# Altium project PWR_MNG.PRJPCB
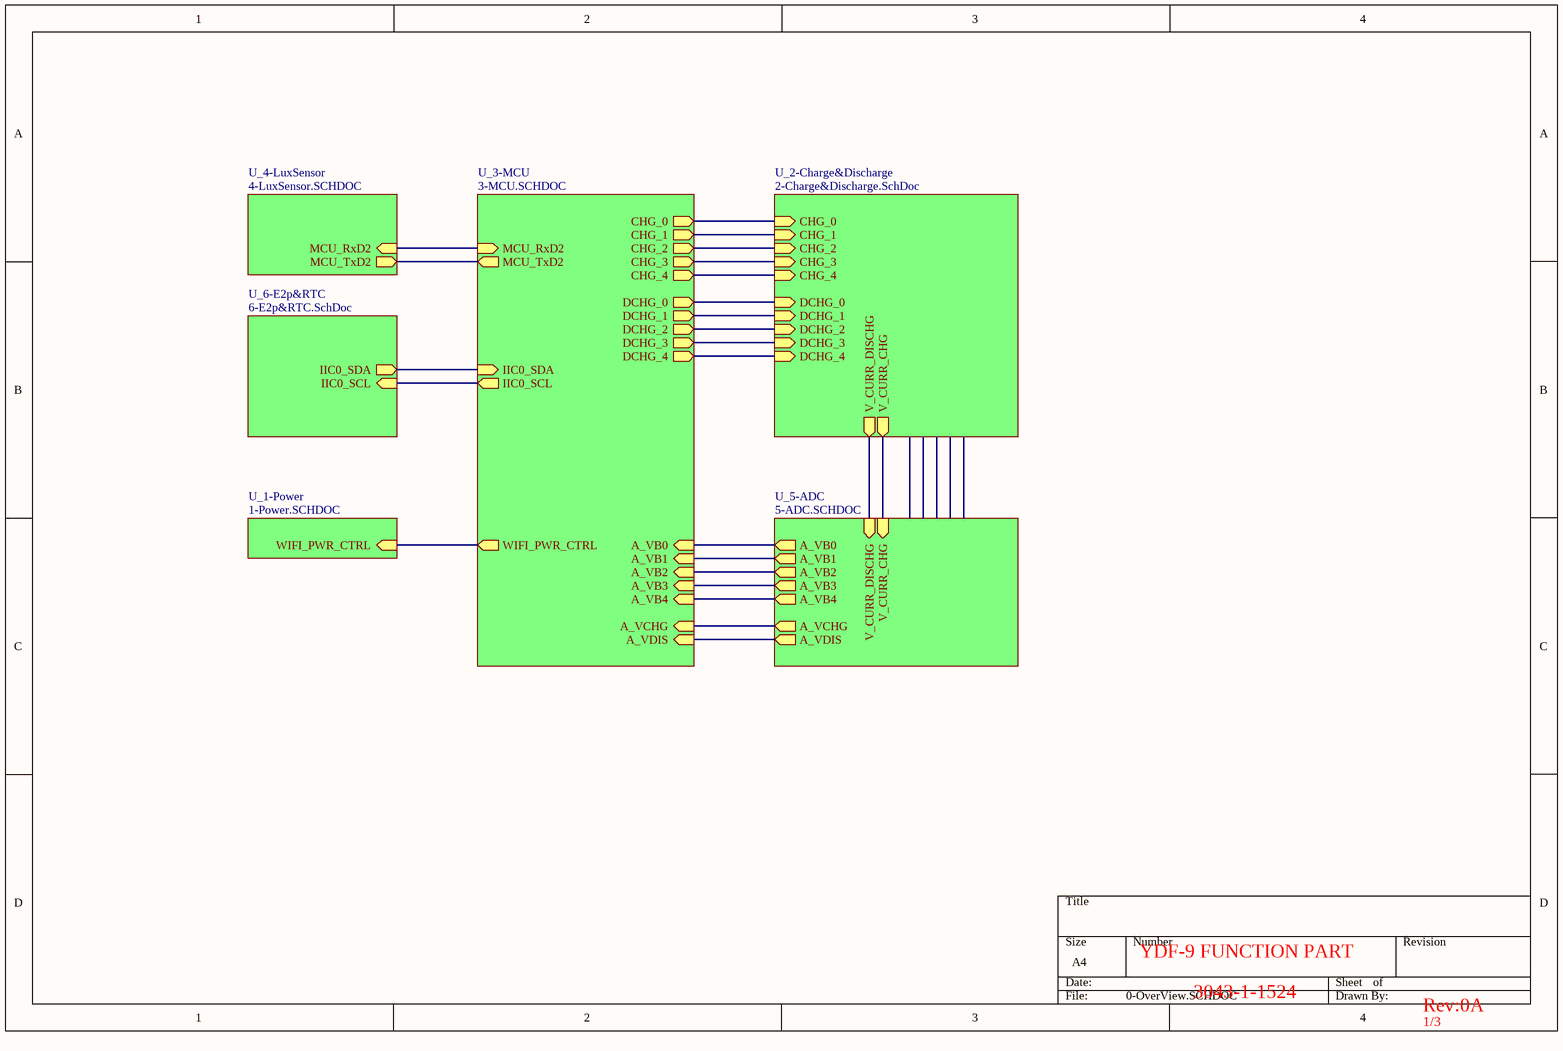
[diagram p0: 0-OverView.SCHDOC]
.TITLE: aaaaa
7 sheets, 72 parts. Net scope: hierarchical (ports join the sheet entries above them; power ports are global).
Board file: 3043-1-1532.PcbDoc
Sheets:
  0-OverView.SCHDOC
    U_2-Charge&Discharge = 2-Charge&Discharge.SchDoc
    U_1-Power = 1-Power.SCHDOC
    U_3-MCU = 3-MCU.SCHDOC
    U_5-ADC = 5-ADC.SCHDOC
    U_6-E2p&RTC = 6-E2p&RTC.SchDoc
    U_4-LuxSensor = 4-LuxSensor.SCHDOC

## Sheet 0-OverView.SCHDOC
size A4

### Sub-sheets
U_1-Power = 1-Power.SCHDOC: WIFI_PWR_CTRL (in)
U_2-Charge&Discharge = 2-Charge&Discharge.SchDoc: V_CURR_CHG (out), V_CURR_DISCHG (out), CHG_2 (in), CHG_3 (in), DCHG_0 (in), CHG_4 (in), CHG_0 (in), DCHG_1 (in), CHG_1 (in), DCHG_2 (in), DCHG_3 (in), DCHG_4 (in)
U_3-MCU = 3-MCU.SCHDOC: IIC0_SDA (in), IIC0_SCL (out), A_VDIS (in), A_VCHG (in), A_VB1 (in), A_VB4 (in), A_VB2 (in), A_VB3 (in), CHG_3 (out), CHG_4 (out), CHG_0 (out), CHG_1 (out), CHG_2 (out), DCHG_0 (out), DCHG_1 (out), DCHG_2 (out), DCHG_3 (out), A_VB0 (in), DCHG_4 (out), WIFI_PWR_CTRL (out), MCU_TxD2 (out), MCU_RxD2 (in)
U_4-LuxSensor = 4-LuxSensor.SCHDOC: MCU_RxD2 (in), MCU_TxD2 (out)
U_5-ADC = 5-ADC.SCHDOC: A_VDIS (out), A_VB3 (out), A_VB1 (out), A_VB4 (out), A_VCHG (out), A_VB2 (out), V_CURR_DISCHG (in), V_CURR_CHG (in), A_VB0 (out)
U_6-E2p&RTC = 6-E2p&RTC.SchDoc: IIC0_SCL (in), IIC0_SDA (out)

### Nets
A_VB0: sheet U_3-MCU/A_VB0, sheet U_5-ADC/A_VB0
A_VB1: sheet U_3-MCU/A_VB1, sheet U_5-ADC/A_VB1
A_VB2: sheet U_3-MCU/A_VB2, sheet U_5-ADC/A_VB2
A_VB3: sheet U_3-MCU/A_VB3, sheet U_5-ADC/A_VB3
A_VB4: sheet U_3-MCU/A_VB4, sheet U_5-ADC/A_VB4
A_VCHG: sheet U_2-Charge&Discharge/V_CURR_CHG, sheet U_3-MCU/A_VCHG, sheet U_5-ADC/A_VCHG, sheet U_5-ADC/V_CURR_CHG
A_VDIS: sheet U_2-Charge&Discharge/V_CURR_DISCHG, sheet U_3-MCU/A_VDIS, sheet U_5-ADC/A_VDIS, sheet U_5-ADC/V_CURR_DISCHG
CHG_0: sheet U_2-Charge&Discharge/CHG_0, sheet U_3-MCU/CHG_0
CHG_1: sheet U_2-Charge&Discharge/CHG_1, sheet U_3-MCU/CHG_1
CHG_2: sheet U_2-Charge&Discharge/CHG_2, sheet U_3-MCU/CHG_2
CHG_3: sheet U_2-Charge&Discharge/CHG_3, sheet U_3-MCU/CHG_3
CHG_4: sheet U_2-Charge&Discharge/CHG_4, sheet U_3-MCU/CHG_4
DCHG_0: sheet U_2-Charge&Discharge/DCHG_0, sheet U_3-MCU/DCHG_0
DCHG_1: sheet U_2-Charge&Discharge/DCHG_1, sheet U_3-MCU/DCHG_1
DCHG_2: sheet U_2-Charge&Discharge/DCHG_2, sheet U_3-MCU/DCHG_2
DCHG_3: sheet U_2-Charge&Discharge/DCHG_3, sheet U_3-MCU/DCHG_3
DCHG_4: sheet U_2-Charge&Discharge/DCHG_4, sheet U_3-MCU/DCHG_4
IIC0_SCL: sheet U_3-MCU/IIC0_SCL, sheet U_6-E2p&RTC/IIC0_SCL
IIC0_SDA: sheet U_3-MCU/IIC0_SDA, sheet U_6-E2p&RTC/IIC0_SDA
MCU_RxD2: sheet U_3-MCU/MCU_RxD2, sheet U_4-LuxSensor/MCU_RxD2
MCU_TxD2: sheet U_3-MCU/MCU_TxD2, sheet U_4-LuxSensor/MCU_TxD2
WIFI_PWR_CTRL: sheet U_1-Power/WIFI_PWR_CTRL, sheet U_3-MCU/WIFI_PWR_CTRL

### Notes on the sheet
- YDF-9 FUNCTION PART
- 3043-1-1524
- Rev:0A
- 1/3

## Sheet 2-Charge&Discharge.SchDoc
size A4
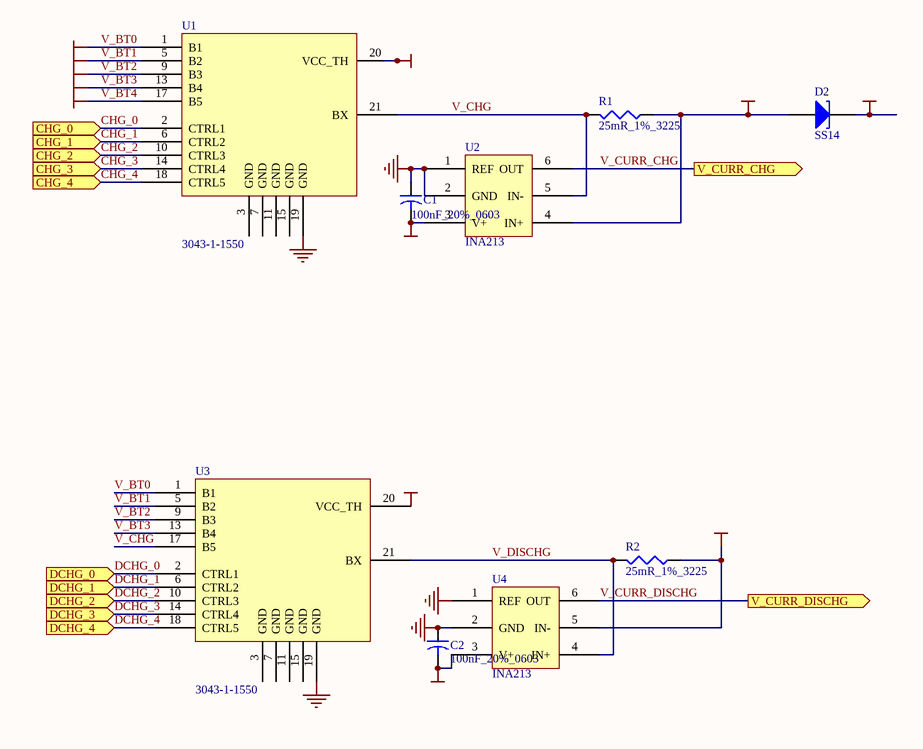
[diagram p1: 2-Charge&Discharge.SchDoc]

### Parts
C1  100nF_20%_0603  [C1608-0603]
C2  100nF_20%_0603  [C1608-0603]
D2  SS14  [DO-214AB_SS14]
R1  25mR_1%_3225  [CC3216-1206]
R2  25mR_1%_3225  [CC3216-1206]
U1  3043-1-1550  [3043-1-1550_V1.10]
U2  INA213  [SC70-6]
U3  3043-1-1550  [3043-1-1550_V1.10]
U4  INA213  [SC70-6]

### Ports
CHG_0 (in), CHG_1 (in), CHG_2 (in), CHG_3 (in), CHG_4 (in), DCHG_0 (in), DCHG_1 (in), DCHG_2 (in), DCHG_3 (in), DCHG_4 (in), V_CURR_CHG (out), V_CURR_DISCHG (out)

### Nets
GND: C1.1 C2.1 U1.19(GND) U2.1(REF) U2.2(GND) U3.19(GND) U4.1(REF) U4.2(GND)
V_BT0: U1.1(B1) U3.1(B1)
V_BT1: U1.5(B2) U3.5(B2)
V_BT2: U1.9(B3) U3.9(B3)
V_BT3: U1.13(B4) U3.13(B4)
V_BT4: D2.2(K) U1.17(B5)
VCC_2V8: C1.2 C2.2 U2.3(V+) U4.3(V+)
VCC_BAT: R2.1 U4.5(IN-)
VCC_CHARGE: D2.1(A) R1.1 U2.4(IN+)
VCC_TH: U1.20(VCC_TH) U3.20(VCC_TH)
CHG_0: U1.2(CTRL1) ; port CHG_0
CHG_1: U1.6(CTRL2) ; port CHG_1
CHG_2: U1.10(CTRL3) ; port CHG_2
CHG_3: U1.14(CTRL4) ; port CHG_3
CHG_4: U1.18(CTRL5) ; port CHG_4
DCHG_0: U3.2(CTRL1) ; port DCHG_0
DCHG_1: U3.6(CTRL2) ; port DCHG_1
DCHG_2: U3.10(CTRL3) ; port DCHG_2
DCHG_3: U3.14(CTRL4) ; port DCHG_3
DCHG_4: U3.18(CTRL5) ; port DCHG_4
V_CHG: R1.2 U1.21(BX) U2.5(IN-) U3.17(B5)
V_CURR_CHG: U2.6(OUT) ; port V_CURR_CHG  [project net A_VCHG]
V_CURR_DISCHG: U4.6(OUT) ; port V_CURR_DISCHG  [project net A_VDIS]
V_DISCHG: R2.2 U3.21(BX) U4.4(IN+)

Not connected (* = marked no-connect by the designer): U1 3(GND) 7(GND) 11(GND) 15(GND); U3 3(GND) 7(GND) 11(GND) 15(GND)

### Library data of the parts
C1 C2 = Cap2: Capacitor; Value: 0.1uF 20% 0603; Published: 23-Sep-2002; Publisher: Altium Limited
D2 = D Tunnel1: Tunnel Diode - RLC Model; Published: 8-Jun-2000; LatestRevisionDate: 17-Jul-2002; LatestRevisionNote: Re-released for DXP Platform.; Publisher: Altium Limited
R1 R2 = Res3: Resistor; Value: 150R %5 0603; Published: 8-Jun-2000; Revision: July-2002: Re-released for DXP Platform.; Publisher: Altium Limited

## Sheet 1-Power.SCHDOC
size A4
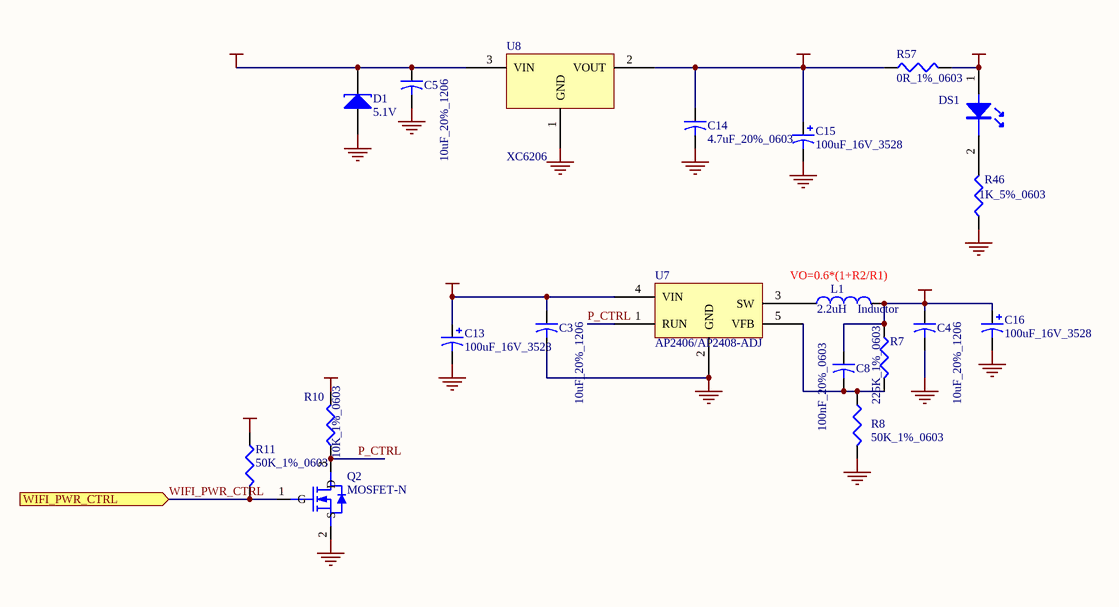
[diagram p2: 1-Power.SCHDOC]

### Parts
C3  10uF_20%_1206  [CC3216-1206]
C4  10uF_20%_1206  [CC3216-1206]
C5  10uF_20%_1206  [CC3216-1206]
C8  100nF_20%_0603  [C1608-0603]
C13  100uF_16V_3528  [CAP_T_B(3528)]
C14  4.7uF_20%_0603  [C1608-0603]
C15  100uF_16V_3528  [CAP_T_B(3528)]
C16  100uF_16V_3528  [CAP_T_B(3528)]
D1  5.1V  [LED0805]
DS1  LED  [LED0805]  (value not drawn)
L1  Inductor  value 2.2uH  [L4x4x2_3A]
Q2  MOSFET-N  [SO-G3/C2.5]
R7  225K_1%_0603  [C1608-0603]
R8  50K_1%_0603  [C1608-0603]
R10  10K_1%_0603  [C1608-0603]
R11  50K_1%_0603  [C1608-0603]
R46  1K_5%_0603  [C1608-0603]
R57  0R_1%_0603  [C1608-0603]
U7  AP2406/AP2408-ADJ  [SOT23-5]
U8  XC6206  [SO-G3/C2.5]

### Ports
WIFI_PWR_CTRL (in)

### Nets
GND: C3.2 C4.2 C5.2 C13.2 C14.2 C15.2 C16.2 D1.1(A) Q2.2(S) R8.2 R46.1 U7.2(GND) U8.1(GND)
V_2V8: C14.1 C15.1 R57.1 U8.2(VOUT)
V_BT4: C3.1 C5.1 C13.1 D1.2(K) R10.2 R11.1 U7.4(VIN) U8.3(VIN)
VCC_2V8: DS1.1 R57.2
VCC_3V3: C4.1 C8.1 C16.1 L1.2 R7.1
P_CTRL: Q2.3(D) R10.1 U7.1(RUN)
WIFI_PWR_CTRL: Q2.1(G) R11.2 ; port WIFI_PWR_CTRL
NetC8_2: C8.2 R7.2 R8.1 U7.5(VFB)
NetDS1_2: DS1.2 R46.2
NetL1_1: L1.1 U7.3(SW)

### Notes on the sheet
- VO=0.6*(1+R2/R1)

### Library data of the parts
C3-C5 = Cap2: Capacitor; Value: 10uF; Published: 23-Sep-2002; Publisher: Altium Limited
C8 = Cap2: Capacitor; Value: 0.1uF; Published: 23-Sep-2002; Publisher: Altium Limited
C13 C15 C16 = Cap Pol2: Polarized Capacitor (Axial); Value: 100uF/16V; Published: 8-Jun-2000; Revision: July-2002: Re-released for DXP Platform.; Publisher: Altium Limited
C14 = Cap2: Capacitor; Value: 0.1uF 20% 0603; Published: 23-Sep-2002; Publisher: Altium Limited
D1 = D Tunnel1: Tunnel Diode - RLC Model; Published: 8-Jun-2000; LatestRevisionDate: 17-Jul-2002; LatestRevisionNote: Re-released for DXP Platform.; Publisher: Altium Limited
R7 R8 R10 R11 R57 = Res3: Resistor; Value: 1K%5 0603; Published: 8-Jun-2000; Revision: July-2002: Re-released for DXP Platform.; Publisher: Altium Limited
R46 = Res3: Resistor; Value: 1K; Published: 8-Jun-2000; Revision: July-2002: Re-released for DXP Platform.; Publisher: Altium Limited
U7 = AP2406
L1 = Inductor: Published: 8-Jun-2000; Revision: July-2002: Re-released for DXP Platform.; Publisher: Altium Limited

## Sheet 3-MCU.SCHDOC
size A4
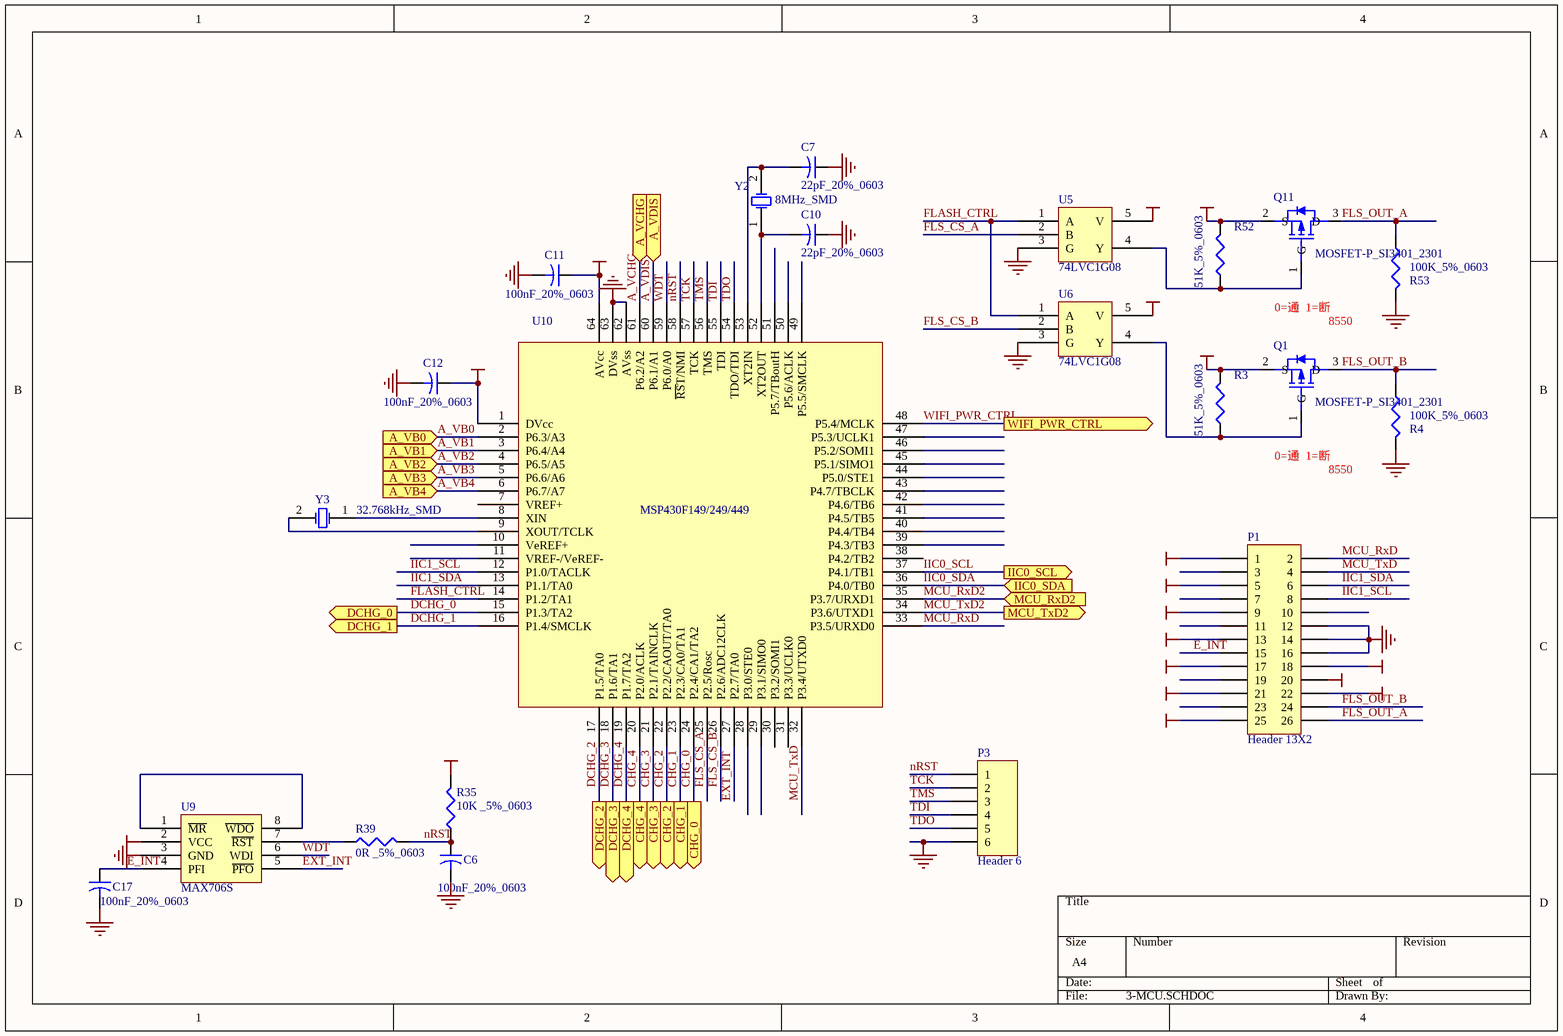
[diagram p3: 3-MCU.SCHDOC]

### Parts
C6  100nF_20%_0603  [C1608-0603]
C7  22pF_20%_0603  [C1608-0603]
C10  22pF_20%_0603  [C1608-0603]
C11  100nF_20%_0603  [C1608-0603]
C12  100nF_20%_0603  [C1608-0603]
C17  100nF_20%_0603  [C1608-0603]
P1  Header 13X2  [HDR2.54_2x13]
P3  Header 6  [SH-06S]
Q1  MOSFET-P_SI3401_2301  [SO-G3/C2.5]
Q11  MOSFET-P_SI3401_2301  [SO-G3/C2.5]
R3  51K_5%_0603  [C1608-0603]
R4  100K_5%_0603  [C1608-0603]
R35  10K _5%_0603  [C1608-0603]
R39  0R _5%_0603  [C1608-0603]
R52  51K_5%_0603  [C1608-0603]
R53  100K_5%_0603  [C1608-0603]
U5  74LVC1G08  [SOT23-5]
U6  74LVC1G08  [SOT23-5]
U9  MAX706S  [SO-8]
U10  MSP430F149/249/449  [QFP-64]
Y2  8MHz_SMD  [XTAL-P4mm_SMD]
Y3  32.768kHz_SMD  [XTAL-3216]

### Ports
A_VB0 (in), A_VB1 (in), A_VB2 (in), A_VB3 (in), A_VB4 (in), A_VCHG (in), A_VDIS (in), CHG_0 (out), CHG_1 (out), CHG_2 (out), CHG_3 (out), CHG_4 (out), DCHG_0 (out), DCHG_1 (out), DCHG_2 (out), DCHG_3 (out), DCHG_4 (out), IIC0_SCL (out), IIC0_SDA (in), MCU_RxD2 (in), MCU_TxD2 (out), WIFI_PWR_CTRL (out)

### Nets
GND: C6.2 C7.1 C10.1 C11.2 C12.2 C17.2 P1.12 P1.14 P1.16 P3.6 R4.2 R53.2 U5.3(G) U6.3(G) U9.3(GND) U10.62(AVss) U10.63(DVss)
V_BT0: P1.1
V_BT1: P1.5
V_BT2: P1.9
V_BT3: P1.13
V_BT4: P1.17 P1.18
VCC_2V8: C11.1 C12.1 P1.20 Q1.2(S) Q11.2(S) R3.2 R35.2 R52.2 U5.5(V) U6.5(V) U9.2(VCC) U10.1(DVcc) U10.64(AVcc)
VCC_BAT: P1.25
VCC_CHARGE: P1.21 P1.22
A_VB0: U10.2(P6.3/A3) ; port A_VB0
A_VB1: U10.3(P6.4/A4) ; port A_VB1
A_VB2: U10.4(P6.5/A5) ; port A_VB2
A_VB3: U10.5(P6.6/A6) ; port A_VB3
A_VB4: U10.6(P6.7/A7) ; port A_VB4
A_VCHG: U10.61(P6.2/A2) ; port A_VCHG
A_VDIS: U10.60(P6.1/A1) ; port A_VDIS
CHG_0: U10.24(P2.4/CA1/TA2) ; port CHG_0
CHG_1: U10.23(P2.3/CA0/TA1) ; port CHG_1
CHG_2: U10.22(P2.2/CAOUT/TA0) ; port CHG_2
CHG_3: U10.21(P2.1/TAINCLK) ; port CHG_3
CHG_4: U10.20(P2.0/ACLK) ; port CHG_4
DCHG_0: U10.15(P1.3/TA2) ; port DCHG_0
DCHG_1: U10.16(P1.4/SMCLK) ; port DCHG_1
DCHG_2: U10.17(P1.5/TA0) ; port DCHG_2
DCHG_3: U10.18(P1.6/TA1) ; port DCHG_3
DCHG_4: U10.19(P1.7/TA2) ; port DCHG_4
E_INT: C17.1 P1.15 U9.4(PFI)
EXT_INT: U9.5(~{PFO}) U10.27(P2.7/TA0)
FLASH_CTRL: U5.1(A) U6.1(A) U10.14(P1.2/TA1)
FLS_CS_A: U5.2(B) U10.25(P2.5/Rosc)
FLS_CS_B: U6.2(B) U10.26(P2.6/ADC12CLK)
FLS_OUT_A: P1.26 Q11.3(D) R53.1
FLS_OUT_B: P1.24 Q1.3(D) R4.1
IIC0_SCL: U10.37(P4.1/TB1) ; port IIC0_SCL
IIC0_SDA: U10.36(P4.0/TB0) ; port IIC0_SDA
IIC1_SCL: P1.8 U10.12(P1.0/TACLK)
IIC1_SDA: P1.6 U10.13(P1.1/TA0)
MCU_RxD: P1.2 U10.33(P3.5/URXD0)
MCU_RxD2: U10.35(P3.7/URXD1) ; port MCU_RxD2
MCU_TxD: P1.4 U10.32(P3.4/UTXD0)
MCU_TxD2: U10.34(P3.6/UTXD1) ; port MCU_TxD2
nRST: C6.1 P3.1 R35.1 R39.2 U10.58(~{RS}T/NMI)
TCK: P3.2 U10.57(TCK)
TDI: P3.4 U10.55(TDI)
TDO: P3.5 U10.54(TDO/TDI)
TMS: P3.3 U10.56(TMS)
WDT: U9.6(WDI) U10.59(P6.0/A0)
WIFI_PWR_CTRL: U10.48(P5.4/MCLK) ; port WIFI_PWR_CTRL
NetC7_2: C7.2 U10.53(XT2IN) Y2.2(OSC2)
NetC10_2: C10.2 U10.52(XT2OUT) Y2.1(OSC1)
NetQ1_1: Q1.1(G) R3.1 U6.4(Y)
NetQ11_1: Q11.1(G) R52.1 U5.4(Y)
NetR39_1: R39.1 U9.7(~{RST})
NetU9_1: U9.1(~{MR}) U9.8(~{WDO})
NetU10_8: U10.8(XIN) Y3.1(OSC1)
NetU10_9: U10.9(XOUT/TCLK) Y3.2(OSC2)

Not connected (* = marked no-connect by the designer): P1 3 7 10 11 19 23; U10 7(VREF+) 10(VeREF+) 11(VREF-/VeREF-) 28(P3.0/STE0) 29(P3.1/SIMO0) 30(P3.2/SOMI1) 31(P3.3/UCLK0) 38(P4.2/TB2) 39(P4.3/TB3) 40(P4.4/TB4) 41(P4.5/TB5) 42(P4.6/TB6) 43(P4.7/TBCLK) 44(P5.0/STE1) 45(P5.1/SIMO1) 46(P5.2/SOMI1) 47(P5.3/UCLK1) 49(P5.5/SMCLK) 50(P5.6/ACLK) 51(P5.7/TBoutH)

### Notes on the sheet
- 0=通  1=断
- 8550

### Library data of the parts
C6 C17 = Cap2: Capacitor; Value: 0.1uF 0603; Published: 23-Sep-2002; Publisher: Altium Limited
C7 C10-C12 = Cap2: Capacitor; Value: 0.1uF 20% 0603; Published: 23-Sep-2002; Publisher: Altium Limited
P1 = Header 13X2: Header, 13-Pin, Dual row; LatestRevisionDate: 17-Jul-2002; LatestRevisionNote: Re-released for DXP Platform.; Publisher: Altium Limited
P3 = Header 6: Header, 6-Pin; LatestRevisionDate: 17-Jul-2002; LatestRevisionNote: Re-released for DXP Platform.; Publisher: Altium Limited
Q1 Q11 = MOSFET-P
R3 R4 R52 R53 = Res3: Resistor; Published: 8-Jun-2000; Revision: July-2002: Re-released for DXP Platform.; Publisher: Altium Limited
R35 R39 = Res3: Resistor; Value: 1M %5 0603_NC; Published: 8-Jun-2000; Revision: July-2002: Re-released for DXP Platform.; Publisher: Altium Limited
U9 = MAX706
Y2 Y3 = XTAL: Crystal Oscillator; Published: 8-Jun-2000; Revision: July-2002: Re-released for DXP Platform.; Publisher: Altium Limited

## Sheet 5-ADC.SCHDOC
size A4
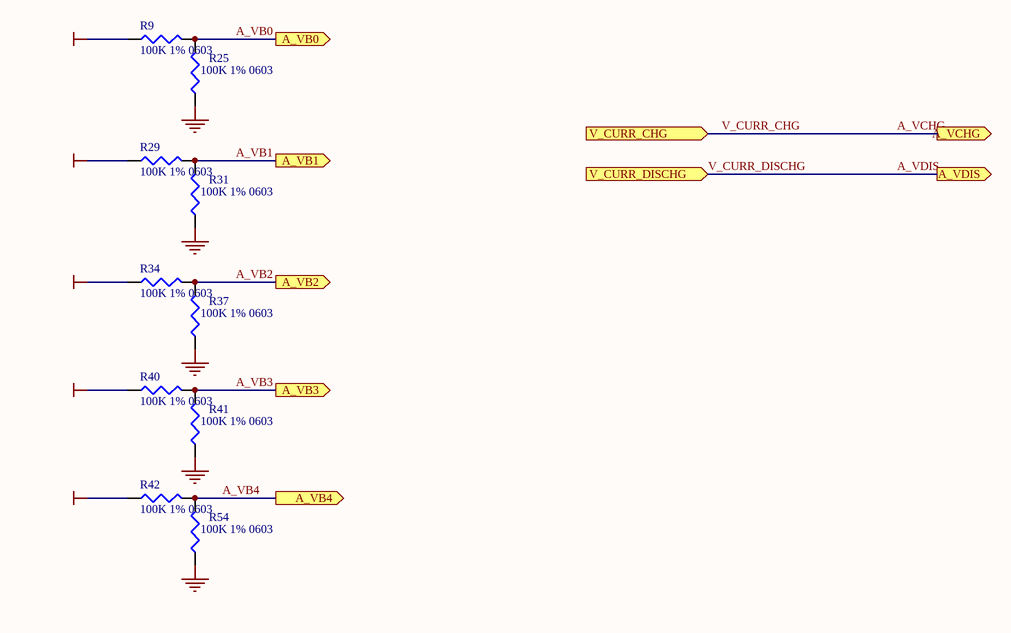
[diagram p4: 5-ADC.SCHDOC]

### Parts
R9  value 100K 1% 0603  [C1608-0603]  (hidden comment: 1K_5%_0603)
R25  value 100K 1% 0603  [C1608-0603]  (hidden comment: 1K_5%_0603)
R29  value 100K 1% 0603  [C1608-0603]  (hidden comment: 1K_5%_0603)
R31  value 100K 1% 0603  [C1608-0603]  (hidden comment: 1K_5%_0603)
R34  value 100K 1% 0603  [C1608-0603]  (hidden comment: 1K_5%_0603)
R37  value 100K 1% 0603  [C1608-0603]  (hidden comment: 1K_5%_0603)
R40  value 100K 1% 0603  [C1608-0603]  (hidden comment: 1K_5%_0603)
R41  value 100K 1% 0603  [C1608-0603]  (hidden comment: 1K_5%_0603)
R42  value 100K 1% 0603  [C1608-0603]  (hidden comment: 1K_5%_0603)
R54  value 100K 1% 0603  [C1608-0603]  (hidden comment: 1K_5%_0603)

### Ports
A_VB0 (out), A_VB1 (out), A_VB2 (out), A_VB3 (out), A_VB4 (out), A_VCHG (out), A_VDIS (out), V_CURR_CHG (in), V_CURR_DISCHG (in)

### Nets
GND: R25.1 R31.1 R37.1 R41.1 R54.1
V_BT0: R9.1
V_BT1: R29.1
V_BT2: R34.1
V_BT3: R40.1
V_BT4: R42.1
A_VB0: R9.2 R25.2 ; port A_VB0
A_VB1: R29.2 R31.2 ; port A_VB1
A_VB2: R34.2 R37.2 ; port A_VB2
A_VB3: R40.2 R41.2 ; port A_VB3
A_VB4: R42.2 R54.2 ; port A_VB4
A_VCHG: port A_VCHG, port V_CURR_CHG  [also labelled V_CURR_CHG]
A_VDIS: port A_VDIS, port V_CURR_DISCHG  [also labelled V_CURR_DISCHG]

### Library data of the parts
R9 R25 R29 R31 R34 R37 R40-R42 R54 = Res3: Resistor; Published: 8-Jun-2000; Revision: July-2002: Re-released for DXP Platform.; Publisher: Altium Limited

## Sheet 6-E2p&RTC.SchDoc
size A4
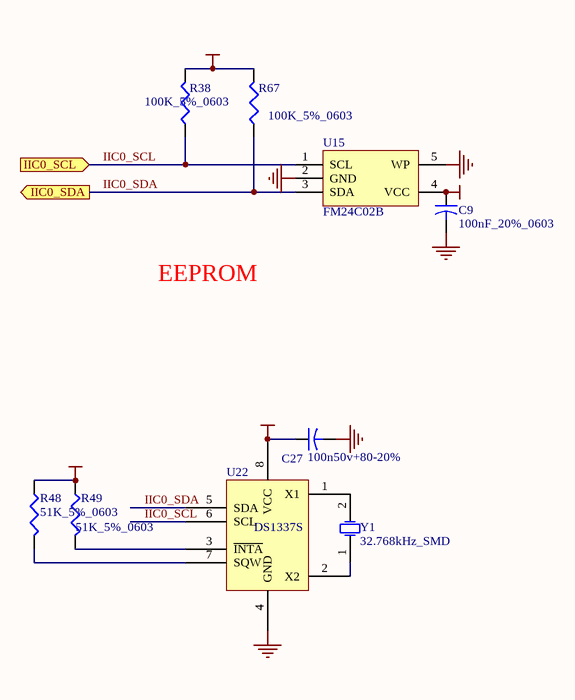
[diagram p5: 6-E2p&RTC.SchDoc]

### Parts
C9  100nF_20%_0603  [C1608-0603]
C27  value 100n50v+80-20%  [C1608-0603]  (hidden comment: Cap2)
R38  100K_5%_0603  [C1608-0603]
R48  51K_5%_0603  [C1608-0603]
R49  51K_5%_0603  [C1608-0603]
R67  100K_5%_0603  [C1608-0603]
U15  FM24C02B  [SOT23-5]
U22  DS1337S  [SO-8]
Y1  32.768kHz_SMD  [XTAL-3216]

### Ports
IIC0_SCL (in), IIC0_SDA (out)

### Nets
GND: C9.2 C27.2 U15.2(GND) U15.5(WP) U22.4(GND)
VCC_2V8: C9.1 C27.1 R38.2 R48.1 R49.1 R67.2 U15.4(VCC) U22.8(VCC)
IIC0_SCL: R38.1 U15.1(SCL) U22.6(SCL) ; port IIC0_SCL
IIC0_SDA: R67.1 U15.3(SDA) U22.5(SDA) ; port IIC0_SDA
NetR48_2: R48.2 U22.7(SQW)
NetR49_2: R49.2 U22.3(~{INTA})
NetU22_1: U22.1(X1) Y1.2(OSC2)
NetU22_2: U22.2(X2) Y1.1(OSC1)

### Notes on the sheet
- EEPROM

### Library data of the parts
C9 = Cap2: Capacitor; Value: 0.1uF 0603; Published: 23-Sep-2002; Publisher: Altium Limited
C27 = Cap2: Capacitor; Published: 23-Sep-2002; Publisher: Altium Limited
R38 R48 R49 R67 = Res3: Resistor; Value: 1K%5 0603; Published: 8-Jun-2000; Revision: July-2002: Re-released for DXP Platform.; Publisher: Altium Limited
Y1 = XTAL: Crystal Oscillator; Published: 8-Jun-2000; Revision: July-2002: Re-released for DXP Platform.; Publisher: Altium Limited

## Sheet 4-LuxSensor.SCHDOC
size A4
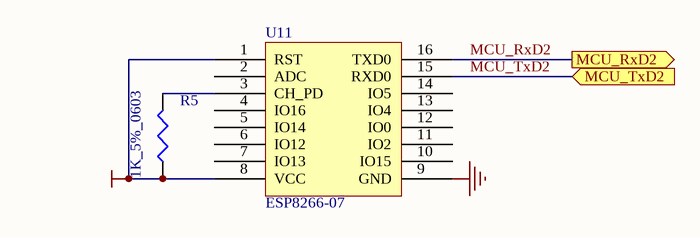
[diagram p6: 4-LuxSensor.SCHDOC]

### Parts
R5  1K_5%_0603  [C1608-0603]
U11  ESP8266-07  [ESP8266-07]

### Ports
MCU_RxD2 (out), MCU_TxD2 (in)

### Nets
GND: U11.9(GND)
VCC_3V3: R5.1 U11.1(RST) U11.8(VCC)
MCU_RxD2: U11.16(TXD0) ; port MCU_RxD2
MCU_TxD2: U11.15(RXD0) ; port MCU_TxD2
NetR5_2: R5.2 U11.3(CH_PD)

Not connected (* = marked no-connect by the designer): U11 2(ADC) 4(IO16) 5(IO14) 6(IO12) 7(IO13) 10(IO15) 11(IO2) 12(IO0) 13(IO4) 14(IO5)

### Library data of the parts
R5 = Res3: Resistor; Published: 8-Jun-2000; Revision: July-2002: Re-released for DXP Platform.; Publisher: Altium Limited

## Nets that join several sheets
GND: 2-Charge&Discharge (8 pins), 1-Power (13 pins), 3-MCU (17 pins), 5-ADC (5 pins), 6-E2p&RTC (5 pins), 4-LuxSensor (U11.9)
V_BT0: 2-Charge&Discharge (U1.1 U3.1), 3-MCU (P1.1), 5-ADC (R9.1)
V_BT1: 2-Charge&Discharge (U1.5 U3.5), 3-MCU (P1.5), 5-ADC (R29.1)
V_BT2: 2-Charge&Discharge (U1.9 U3.9), 3-MCU (P1.9), 5-ADC (R34.1)
V_BT3: 2-Charge&Discharge (U1.13 U3.13), 3-MCU (P1.13), 5-ADC (R40.1)
V_BT4: 2-Charge&Discharge (D2.2 U1.17), 1-Power (8 pins), 3-MCU (P1.17 P1.18), 5-ADC (R42.1)
VCC_2V8: 2-Charge&Discharge (C1.2 C2.2 U2.3 U4.3), 1-Power (DS1.1 R57.2), 3-MCU (13 pins), 6-E2p&RTC (8 pins)
VCC_3V3: 1-Power (5 pins), 4-LuxSensor (R5.1 U11.1 U11.8)
VCC_BAT: 2-Charge&Discharge (R2.1 U4.5), 3-MCU (P1.25)
VCC_CHARGE: 2-Charge&Discharge (D2.1 R1.1 U2.4), 3-MCU (P1.21 P1.22)
A_VB0: 3-MCU (U10.2), 5-ADC (R9.2 R25.2)
A_VB1: 3-MCU (U10.3), 5-ADC (R29.2 R31.2)
A_VB2: 3-MCU (U10.4), 5-ADC (R34.2 R37.2)
A_VB3: 3-MCU (U10.5), 5-ADC (R40.2 R41.2)
A_VB4: 3-MCU (U10.6), 5-ADC (R42.2 R54.2)
A_VCHG: 2-Charge&Discharge (U2.6), 3-MCU (U10.61)
A_VDIS: 2-Charge&Discharge (U4.6), 3-MCU (U10.60)
CHG_0: 2-Charge&Discharge (U1.2), 3-MCU (U10.24)
CHG_1: 2-Charge&Discharge (U1.6), 3-MCU (U10.23)
CHG_2: 2-Charge&Discharge (U1.10), 3-MCU (U10.22)
CHG_3: 2-Charge&Discharge (U1.14), 3-MCU (U10.21)
CHG_4: 2-Charge&Discharge (U1.18), 3-MCU (U10.20)
DCHG_0: 2-Charge&Discharge (U3.2), 3-MCU (U10.15)
DCHG_1: 2-Charge&Discharge (U3.6), 3-MCU (U10.16)
DCHG_2: 2-Charge&Discharge (U3.10), 3-MCU (U10.17)
DCHG_3: 2-Charge&Discharge (U3.14), 3-MCU (U10.18)
DCHG_4: 2-Charge&Discharge (U3.18), 3-MCU (U10.19)
IIC0_SCL: 3-MCU (U10.37), 6-E2p&RTC (R38.1 U15.1 U22.6)
IIC0_SDA: 3-MCU (U10.36), 6-E2p&RTC (R67.1 U15.3 U22.5)
MCU_RxD2: 3-MCU (U10.35), 4-LuxSensor (U11.16)
MCU_TxD2: 3-MCU (U10.34), 4-LuxSensor (U11.15)
WIFI_PWR_CTRL: 1-Power (Q2.1 R11.2), 3-MCU (U10.48)